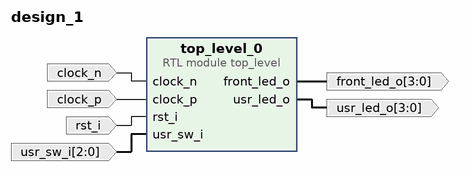
[diagram p0: block diagram of the top level]
# Vivado block design design_1, Vivado 2016.2
create_bd_design design_1

create_bd_port -dir I -type clk clock_n
create_bd_port -dir I -type clk clock_p
create_bd_port -dir I rst_i
create_bd_port -dir I -from 2 -to 0 usr_sw_i
create_bd_port -dir O -from 3 -to 0 usr_led_o
create_bd_port -dir O -from 3 -to 0 front_led_o

create_bd_cell -type module -reference top_level top_level_0

# ---- connections ----

connect_bd_net [get_bd_ports clock_n] [get_bd_pins top_level_0/clock_n]
connect_bd_net [get_bd_ports clock_p] [get_bd_pins top_level_0/clock_p]
connect_bd_net [get_bd_ports rst_i] [get_bd_pins top_level_0/rst_i]
connect_bd_net [get_bd_ports usr_sw_i] [get_bd_pins top_level_0/usr_sw_i]
connect_bd_net [get_bd_pins top_level_0/usr_led_o] [get_bd_ports usr_led_o]
connect_bd_net [get_bd_pins top_level_0/front_led_o] [get_bd_ports front_led_o]

validate_bd_design
save_bd_design
